# Altium project LPF.PrjPcb
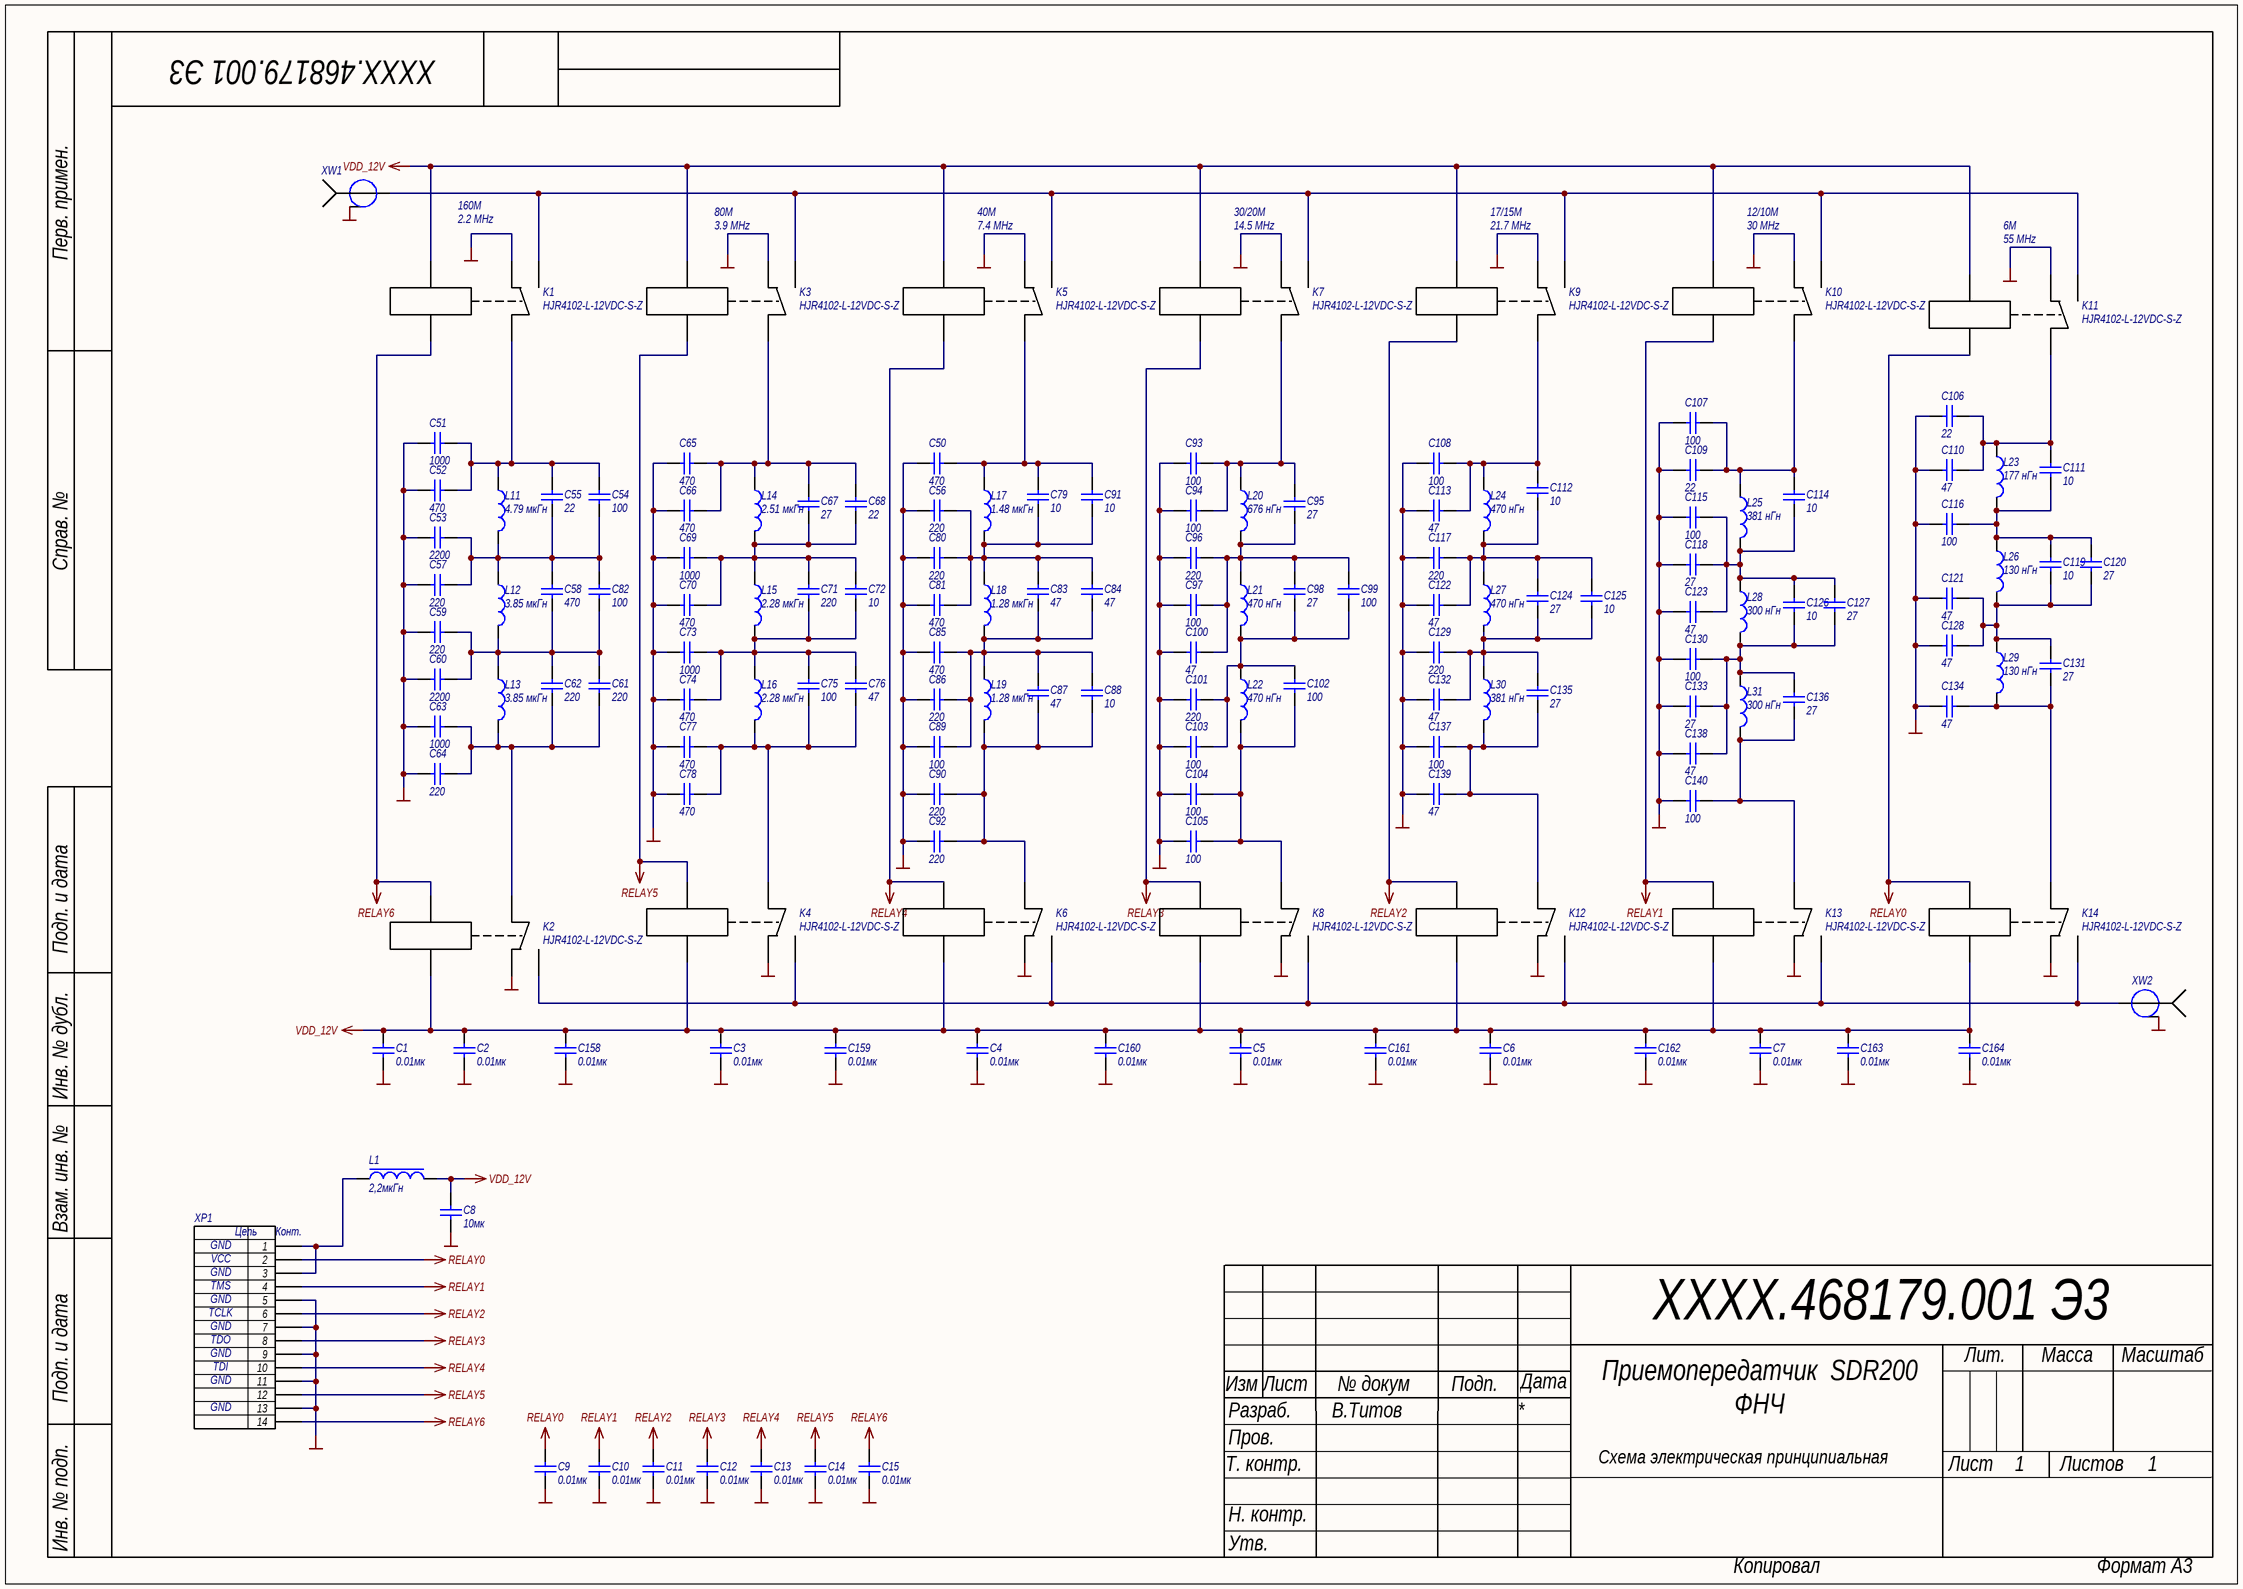
[diagram p0: LPF.SchDoc]
1 sheet, 152 parts. Net scope: global (net labels, ports and power ports of the same name join across sheets).
Board file: LPF.PcbDoc

## Sheet LPF.SchDoc: Приемопередатчик  SDR200
size 420 x 297 mm; Author: В.Титов; DrawnBy: В.Титов; DocumentNumber: ХХХХ.468179.001 Э3; SheetNumber: 1; SheetTotal: 1; DocumentType: Схема электрическая принципиальная; Title2: ФНЧ; Scale: 1:1

### Parts
C1  0.01мк  [CAPC1005X06N]
C2  0.01мк  [CAPC1005X06N]
C3  0.01мк  [CAPC1005X06N]
C4  0.01мк  [CAPC1005X06N]
C5  0.01мк  [CAPC1005X06N]
C6  0.01мк  [CAPC1005X06N]
C7  0.01мк  [CAPC1005X06N]
C8  10мк  [CAPC3225X27L]
C9  0.01мк  [CAPC1005X06N]
C10  0.01мк  [CAPC1005X06N]
C11  0.01мк  [CAPC1005X06N]
C12  0.01мк  [CAPC1005X06N]
C13  0.01мк  [CAPC1005X06N]
C14  0.01мк  [CAPC1005X06N]
C15  0.01мк  [CAPC1005X06N]
C50  470  [CAPC3216X19L]
C51  1000  [CAPC3216X19L]
C52  470  [CAPC3216X19L]
C53  2200  [CAPC3216X19L]
C54  100  [CAPC3216X19L]
C55  22  [CAPC3216X19L]
C56  220  [CAPC3216X19L]
C57  220  [CAPC3216X19L]
C58  470  [CAPC3216X19L]
C59  220  [CAPC3216X19L]
C60  2200  [CAPC3216X19L]
C61  220  [CAPC3216X19L]
C62  220  [CAPC3216X19L]
C63  1000  [CAPC3216X19L]
C64  220  [CAPC3216X19L]
C65  470  [CAPC3216X19L]
C66  470  [CAPC3216X19L]
C67  27  [CAPC3216X19L]
C68  22  [CAPC3216X19L]
C69  1000  [CAPC3216X19L]
C70  470  [CAPC3216X19L]
C71  220  [CAPC3216X19L]
C72  10  [CAPC3216X19L]
C73  1000  [CAPC3216X19L]
C74  470  [CAPC3216X19L]
C75  100  [CAPC3216X19L]
C76  47  [CAPC3216X19L]
C77  470  [CAPC3216X19L]
C78  470  [CAPC3216X19L]
C79  10  [CAPC3216X19L]
C80  220  [CAPC3216X19L]
C81  470  [CAPC3216X19L]
C82  100  [CAPC3216X19L]
C83  47  [CAPC3216X19L]
C84  47  [CAPC3216X19L]
C85  470  [CAPC3216X19L]
C86  220  [CAPC3216X19L]
C87  47  [CAPC3216X19L]
C88  10  [CAPC3216X19L]
C89  100  [CAPC3216X19L]
C90  220  [CAPC3216X19L]
C91  10  [CAPC3216X19L]
C92  220  [CAPC3216X19L]
C93  100  [CAPC3216X19L]
C94  100  [CAPC3216X19L]
C95  27  [CAPC3216X19L]
C96  220  [CAPC3216X19L]
C97  100  [CAPC3216X19L]
C98  27  [CAPC3216X19L]
C99  100  [CAPC3216X19L]
C100  47  [CAPC3216X19L]
C101  220  [CAPC3216X19L]
C102  100  [CAPC3216X19L]
C103  100  [CAPC3216X19L]
C104  100  [CAPC3216X19L]
C105  100  [CAPC3216X19L]
C106  22  [CAPC3216X19L]
C107  100  [CAPC3216X19L]
C108  100  [CAPC3216X19L]
C109  22  [CAPC3216X19L]
C110  47  [CAPC3216X19L]
C111  10  [CAPC3216X19L]
C112  10  [CAPC3216X19L]
C113  47  [CAPC3216X19L]
C114  10  [CAPC3216X19L]
C115  100  [CAPC3216X19L]
C116  100  [CAPC3216X19L]
C117  220  [CAPC3216X19L]
C118  27  [CAPC3216X19L]
C119  10  [CAPC3216X19L]
C120  27  [CAPC3216X19L]
C121  47  [CAPC3216X19L]
C122  47  [CAPC3216X19L]
C123  47  [CAPC3216X19L]
C124  27  [CAPC3216X19L]
C125  10  [CAPC3216X19L]
C126  10  [CAPC3216X19L]
C127  27  [CAPC3216X19L]
C128  47  [CAPC3216X19L]
C129  220  [CAPC3216X19L]
C130  100  [CAPC3216X19L]
C131  27  [CAPC3216X19L]
C132  47  [CAPC3216X19L]
C133  27  [CAPC3216X19L]
C134  47  [CAPC3216X19L]
C135  27  [CAPC3216X19L]
C136  27  [CAPC3216X19L]
C137  100  [CAPC3216X19L]
C138  47  [CAPC3216X19L]
C139  47  [CAPC3216X19L]
C140  100  [CAPC3216X19L]
C158  0.01мк  [CAPC1005X06N]
C159  0.01мк  [CAPC1005X06N]
C160  0.01мк  [CAPC1005X06N]
C161  0.01мк  [CAPC1005X06N]
C162  0.01мк  [CAPC1005X06N]
C163  0.01мк  [CAPC1005X06N]
C164  0.01мк  [CAPC1005X06N]
K1  HJR4102-L-12VDC-S-Z  [HJR4102]
K2  HJR4102-L-12VDC-S-Z  [HJR4102]
K3  HJR4102-L-12VDC-S-Z  [HJR4102]
K4  HJR4102-L-12VDC-S-Z  [HJR4102]
K5  HJR4102-L-12VDC-S-Z  [HJR4102]
K6  HJR4102-L-12VDC-S-Z  [HJR4102]
K7  HJR4102-L-12VDC-S-Z  [HJR4102]
K8  HJR4102-L-12VDC-S-Z  [HJR4102]
K9  HJR4102-L-12VDC-S-Z  [HJR4102]
K10  HJR4102-L-12VDC-S-Z  [HJR4102]
K11  HJR4102-L-12VDC-S-Z  [HJR4102]
K12  HJR4102-L-12VDC-S-Z  [HJR4102]
K13  HJR4102-L-12VDC-S-Z  [HJR4102]
K14  HJR4102-L-12VDC-S-Z  [HJR4102]
L1  2,2мкГн  [CSAB0420]
L11  4.79 мкГн  [T68-2]
L12  3.85 мкГн  [T68-2]
L13  3.85 мкГн  [T68-2]
L14  2.51 мкГн  [T68-2]
L15  2.28 мкГн  [T68-2]
L16  2.28 мкГн  [T68-2]
L17  1.48 мкГн  [T68-2]
L18  1.28 мкГн  [T68-2]
L19  1.28 мкГн  [T68-2]
L20  676 нГн  [T68-6]
L21  470 нГн  [T68-6]
L22  470 нГн  [T68-6]
L23  177 нГн  [COIL D11 W4 L6]
L24  470 нГн  [T68-6]
L25  381 нГн  [T68-6]
L26  130 нГн  [COIL D11 W4 L10]
L27  470 нГн  [T68-6]
L28  300 нГн  [T68-6]
L29  130 нГн  [COIL D11 W4 L10]
L30  381 нГн  [T68-6]
L31  300 нГн  [T68-6]
XP1  IDC2-14MS  [IDC2-14MS]  (value not drawn)
XW1  SMA-JR  [SMA-JR]  (value not drawn)
XW2  SMA-JR  [SMA-JR]  (value not drawn)

### Nets
GND: C1.1 C2.1 C3.1 C4.1 C5.1 C6.1 C7.1 C8.1 C9.1 C10.1 C11.1 C12.1 C13.1 C14.1 C15.1 C50.2 C51.2 C52.2 C53.2 C56.2 C57.2 C59.2 C60.2 C63.2 C64.2 C65.2 C66.2 C69.2 C70.2 C73.2 C74.2 C77.2 C78.2 C80.2 C81.2 C85.2 C86.2 C89.2 C90.2 C92.2 C93.2 C94.2 C96.2 C97.2 C100.2 C101.2 C103.2 C104.2 C105.2 C106.2 C107.2 C108.2 C109.2 C110.2 C113.2 C115.2 C116.2 C117.2 C118.2 C121.2 C122.2 C123.2 C128.2 C129.2 C130.2 C132.2 C133.2 C134.2 C137.2 C138.2 C139.2 C140.2 C158.1 C159.1 C160.1 C161.1 C162.1 C163.1 C164.1 K1.7 K2.7 K3.7 K4.7 K5.7 K6.7 K7.7 K8.7 K9.7 K10.7 K11.7 K12.7 K13.7 K14.7 XP1.5 XP1.7 XP1.9 XP1.11 XP1.13 XW1.2 XW2.2
RELAY0: C9.2 K11.5 K14.5 XP1.2
RELAY1: C10.2 K10.5 K13.5 XP1.4
RELAY2: C11.2 K9.5 K12.5 XP1.6
RELAY3: C12.2 K7.5 K8.5 XP1.8
RELAY4: C13.2 K5.5 K6.5 XP1.10
RELAY5: C14.2 K3.5 K4.5 XP1.12
RELAY6: C15.2 K1.5 K2.5 XP1.14
VDD_12V: C1.2 C2.2 C3.2 C4.2 C5.2 C6.2 C7.2 C8.2 C158.2 C159.2 C160.2 C161.2 C162.2 C163.2 C164.2 K1.8 K2.8 K3.8 K4.8 K5.8 K6.8 K7.8 K8.8 K9.8 K10.8 K11.8 K12.8 K13.8 K14.8 L1.2
NetC50_1: C50.1 C79.2 C91.2 K5.12 L17.1
NetC51_1: C51.1 C52.1 C54.2 C55.2 K1.12 L11.1
NetC53_1: C53.1 C54.1 C55.1 C57.1 C58.2 C82.2 L11.2 L12.1
NetC56_1: C56.1 C79.1 C80.1 C81.1 C83.2 C84.2 C91.1 L17.2 L18.1
NetC58_1: C58.1 C59.1 C60.1 C61.2 C62.2 C82.1 L12.2 L13.1
NetC61_1: C61.1 C62.1 C63.1 C64.1 K2.12 L13.2
NetC65_1: C65.1 C66.1 C67.2 C68.2 K3.12 L14.1
NetC67_1: C67.1 C68.1 C69.1 C70.1 C71.1 C72.2 L14.2 L15.1
NetC71_2: C71.2 C72.1 C73.1 C74.1 C75.2 C76.2 L15.2 L16.1
NetC75_1: C75.1 C76.1 C77.1 C78.1 K4.12 L16.2
NetC83_1: C83.1 C84.1 C85.1 C86.1 C87.2 C88.2 C89.1 L18.2 L19.1
NetC87_1: C87.1 C88.1 C90.1 C92.1 K6.12 L19.2
NetC93_1: C93.1 C94.1 C95.2 K7.12 L20.1
NetC95_1: C95.1 C96.1 C97.1 C98.2 C99.2 C100.1 L20.2 L21.1
NetC98_1: C98.1 C99.1 C101.1 C102.2 C103.1 L21.2 L22.1
NetC102_1: C102.1 C104.1 C105.1 K8.12 L22.2
NetC106_1: C106.1 C110.1 C111.2 K11.12 L23.1
NetC107_1: C107.1 C109.1 C114.2 K10.12 L25.1
NetC108_1: C108.1 C112.2 C113.1 K9.12 L24.1
NetC111_1: C111.1 C116.1 C119.2 C120.2 L23.2 L26.1
NetC112_1: C112.1 C117.1 C122.1 C124.2 C125.2 L24.2 L27.1
NetC114_1: C114.1 C115.1 C118.1 C123.1 C126.2 C127.2 L25.2 L28.1
NetC119_1: C119.1 C120.1 C121.1 C128.1 C131.2 L26.2 L29.1
NetC124_1: C124.1 C125.1 C129.1 C132.1 C135.2 L27.2 L30.1
NetC126_1: C126.1 C127.1 C130.1 C133.1 C136.2 C138.1 L28.2 L31.1
NetC131_1: C131.1 C134.1 K14.12 L29.2
NetC135_1: C135.1 C137.1 C139.1 K12.12 L30.2
NetC136_1: C136.1 C140.1 K13.12 L31.2
NetK1_6: K1.6 K3.6 K5.6 K7.6 K9.6 K10.6 K11.6 XW1.1
NetK2_6: K2.6 K4.6 K6.6 K8.6 K12.6 K13.6 K14.6 XW2.1
NetL1_1: L1.1 XP1.1 XP1.3

### Notes on the sheet
- 2.2 MHz
- 160M
- 3.9 MHz
- 80M
- 7.4 MHz
- 40M
- 14.5 MHz
- 30/20M
- 21.7 MHz
- 17/15M
- 30 MHz
- 12/10M
- 55 MHz
- 6M
- Перв. примен.
- Справ. №
- Подп. и дата
- Инв. № дубл.
- Взам. инв. №
- Изм
- Лист
- № докум
- Подп.
- Дата
- Лит.
- Масса
- Масштаб
- Т. контр.
- Разраб.
- Пров.
- Листов
- Н. контр.
- Инв. № подп.
- Утв.
- Копировал
- Формат А3
- (in symbol Соединитель IDC2-14MS) Цепь; Конт.; GND; VCC; TMS; TCLK; TDO; TDI

### Library data of the parts
C1-C7 C9-C15 C158-C164 = Кер.ЧИП конд. 0402 0.01мкФ X7R 10%, 50В: Кер. ЧИП-конденсатор; Power/Voltage: 50В; TKE: X7R; Tolerance: ±20%; Value: 0.01мк
C8 = Кер.ЧИП конд. 1210 10мкФ X5R 20% 50В: Кер. ЧИП-конденсатор; Manufacturer: Murata; ManufacturerPartNumber: GRM32ER71H106; Power/Voltage: 50В; TKE: X5R; Tolerance: ±20%; Value: 10мк
C50 C52 C58 C65 C66 C70 C74 C77 C78 C81 C85 = Кер.ЧИП конд. 1206 470пФ NP0 10% 2000В: Кер. ЧИП-конденсатор; Manufacturer: WALSIN; ManufacturerPartNumber: 1206B471K202; Power/Voltage: 2000В; TKE: NP0; Tolerance: ±10%; Value: 470
C51 C63 C69 C73 = Кер.ЧИП конд. 1206 1000пФ X7К 10% 2000В: Кер. ЧИП-конденсатор; Manufacturer: Johanson; ManufacturerPartNumber: 202R18W102KV4E; Power/Voltage: 2000В; TKE: X7R; Tolerance: ±10%; Value: 1000
C53 C60 = Кер.ЧИП конд. 1206 2200пФ X7К 10% 1000В: Кер. ЧИП-конденсатор; Manufacturer: WALSIN; ManufacturerPartNumber: 1206B222K102; Power/Voltage: 1000В; TKE: X7R; Tolerance: ±10%; Value: 2200
C54 C75 C82 C89 C93 C94 C97 C99 C102-C105 C107 C108 C115 C116 C130 C137 C140 = Кер.ЧИП конд. 1206 100пФ NP0 5% 2000В: Кер. ЧИП-конденсатор; Manufacturer: WALSIN; ManufacturerPartNumber: 1206N101J202; Power/Voltage: 2000В; TKE: NP0; Tolerance: ±5%; Value: 100
C55 C68 C106 C109 = Кер.ЧИП конд. 1206 22пФ NP0 5% 2000В: Кер. ЧИП-конденсатор; Manufacturer: WALSIN; ManufacturerPartNumber: 1206N220J202; Power/Voltage: 2000В; TKE: NP0; Tolerance: ±5%; Value: 22
C56 C57 C59 C61 C62 C64 C71 C80 C86 C90 C92 C96 C101 C117 C129 = Кер.ЧИП конд. 1206 220пФ NP0 5% 2000В: Кер. ЧИП-конденсатор; Manufacturer: Johanson; ManufacturerPartNumber: 202R18W102KV4E; Power/Voltage: 2000В; TKE: X7R; Tolerance: ±10%; Value: 220
C67 C95 C98 C118 C120 C124 C127 C131 C133 C135 C136 = Кер.ЧИП конд. 1206 27пФ NP0 10% 2000В: Кер. ЧИП-конденсатор; Manufacturer: WALSIN; ManufacturerPartNumber: 1206N270J202; Power/Voltage: 2000В; TKE: NP0; Tolerance: ±10%; Value: 27
C72 C79 C88 C91 C111 C112 C114 C119 C125 C126 = Кер.ЧИП конд. 1206 10пФ NP0 5% 2000В: Кер. ЧИП-конденсатор; Manufacturer: WALSIN; ManufacturerPartNumber: 1206N100J202; Power/Voltage: 2000В; TKE: NP0; Tolerance: ±5%; Value: 10
C76 C83 C84 C87 C100 C110 C113 C121-C123 C128 C132 C134 C138 C139 = Кер.ЧИП конд. 1206 47пФ NP0 5% 2000В: Кер. ЧИП-конденсатор; Manufacturer: WALSIN; ManufacturerPartNumber: 1206N470J202; Power/Voltage: 2000В; TKE: NP0; Tolerance: ±5%; Value: 47
K1-K14 = Реле HJR4102-L-12VDC-S-Z: Реле 1пер. 12VDC, 1A/240VAC; Value: HJR4102-L-12VDC-S-Z; ComponentLink1Description: datasheet; ComponentLink1URL: https://www.ti.com/lit/ds/symlink/tlvh431a.pdf?ts=1606914625003&ref_url=https%253A%252F%252Fwww.google.com%252F
L1 = ЧИП индуктивность CSAB0420-2R2M: Molding Power Choke; Manufacturer: Vishay; ManufacturerPartNumber: IHLP1616ABER1R0M11; Value: 2,2мкГн
L11 = Индуктивность T68-2 4.79 мкГн: 29 витков; Value: 4.79 мкГн
L12 L13 = Индуктивность T68-2 3.85 мкГн: 26 витков; Value: 3.85 мкГн
L14 = Индуктивность T68-2 2.51 мкГн: 21 виток; Value: 2.51 мкГн
L15 L16 = Индуктивность T68-2 2.28 мкГн: Value: 2.28 мкГн
L17 = Индуктивность T68-2 1.48 мкГн: 16 витков; Value: 1.48 мкГн
L18 L19 = Индуктивность T68-2 1.28 мкГн: 16 витков; Value: 1.28 мкГн
L20 = Индуктивность T68-6 676 нГн: 12 витков; Value: 676 нГн
L21 L22 L24 L27 = Индуктивность T68-6 470 нГн: 10 витков; Value: 470 нГн
L23 = Индуктивность 177 нГн: 4 витка, диаметр 11мм, длина 6мм; Value: 177 нГн
L25 L30 = Индуктивность T68-6 381 нГн: 9 витков; Value: 381 нГн
L26 L29 = Индуктивность 130 нГн: 4 витка, диаметр 11мм, длина 10мм; Value: 130 нГн
L28 L31 = Индуктивность T68-6 300 нГн: 8 витков; Value: 300 нГн
XP1 = Соединитель IDC2-14MS: JTAG Xilinx IDC2-14MS; Manufacturer: Molex; Value: IDC2-14MS
XW1 XW2 = Соединитель коаксиальный SMA-JR: SMA-JR Разъем SMA гнездо на плату, прямой угол; Value: SMA-JR; ComponentLink1Description: datasheet; ComponentLink1URL: http://www.brownbear.ru/goods/2243.html